# EAGLE schematic template (EAGLE 6.5.0)
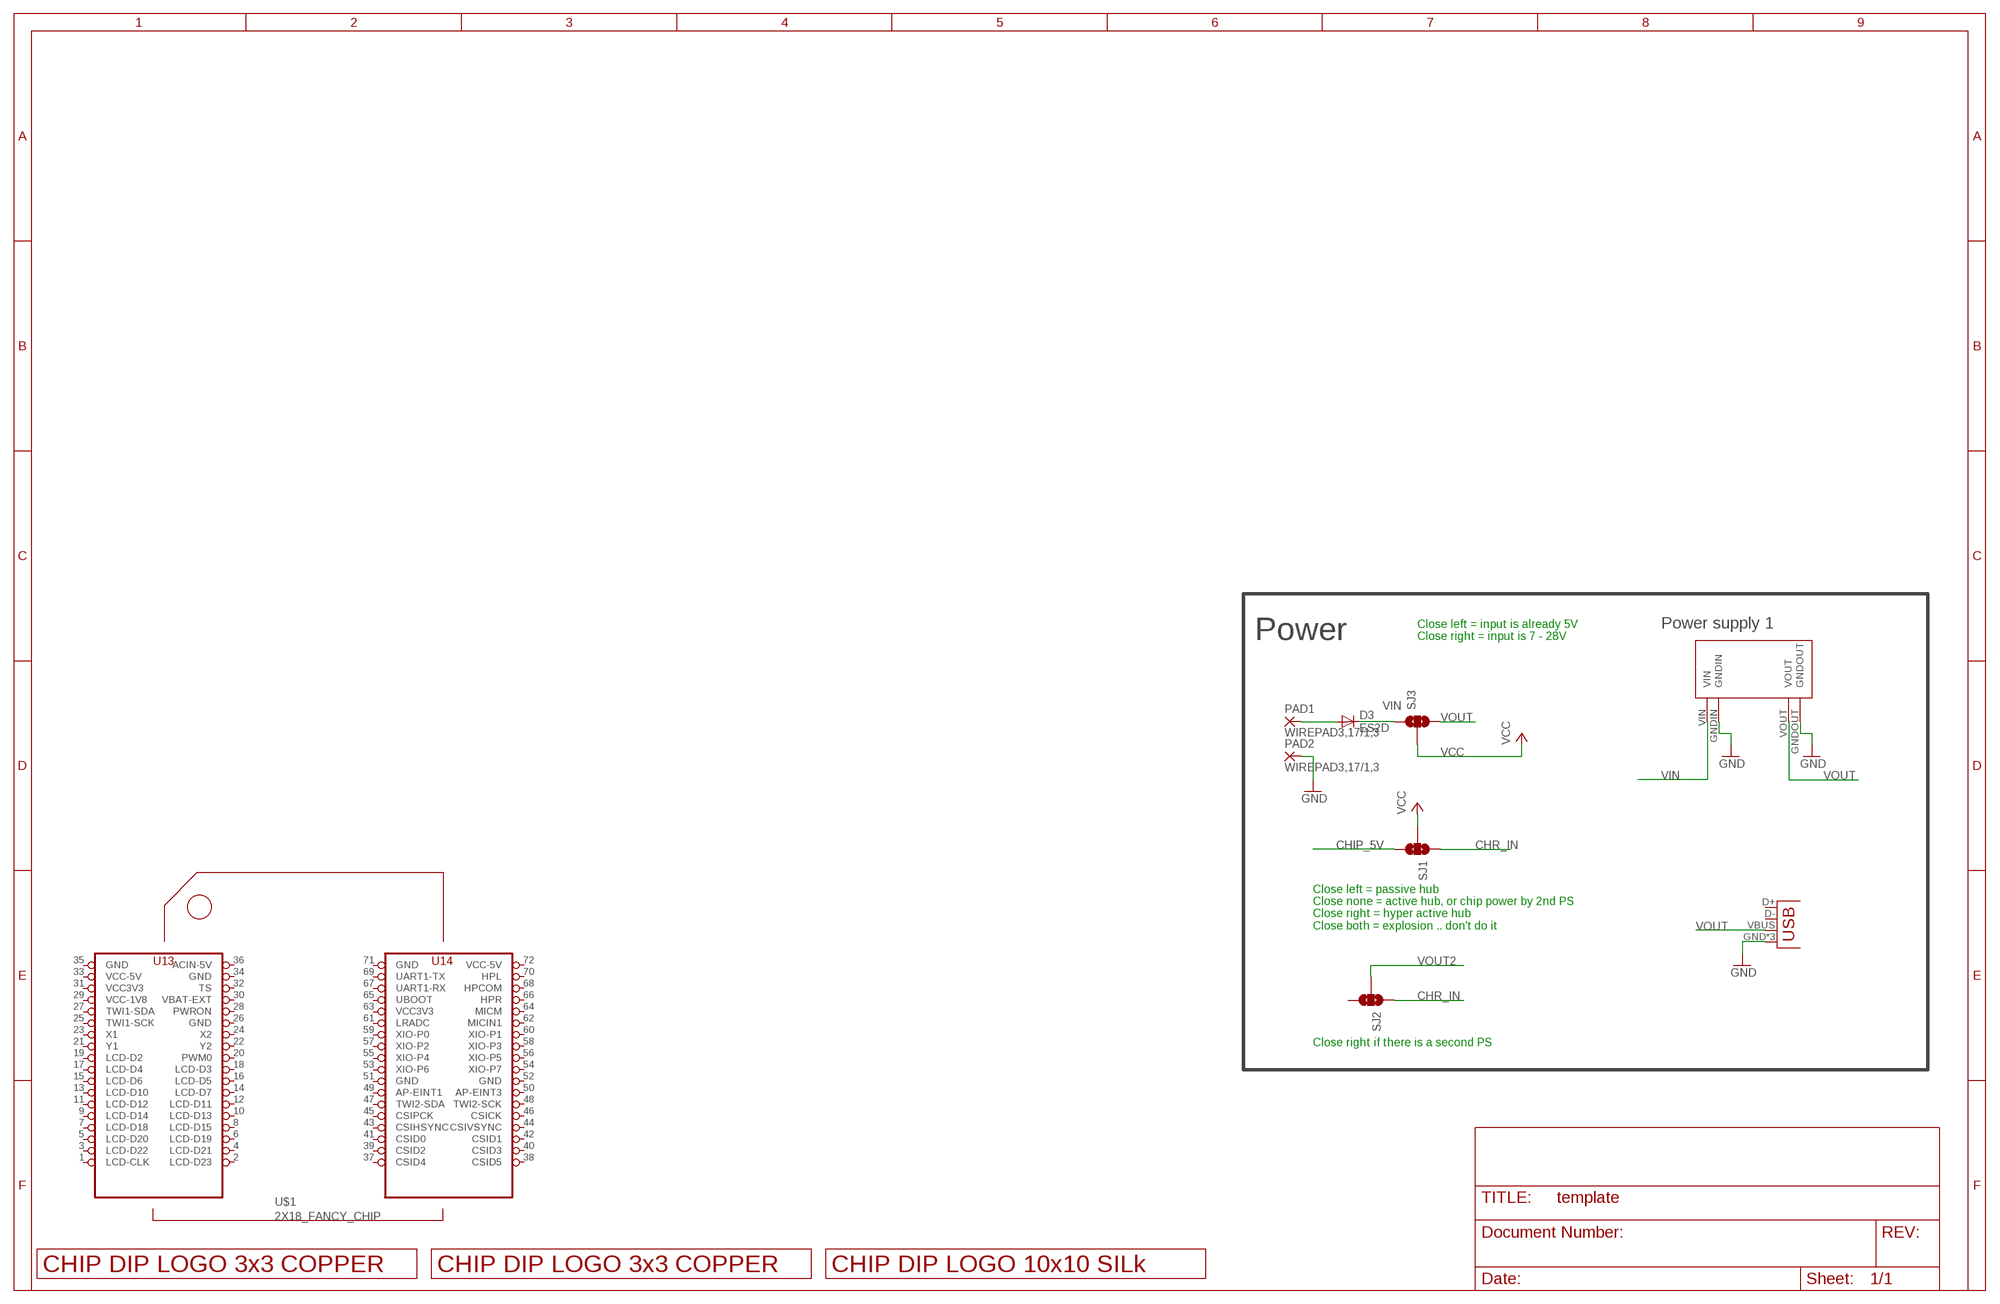
[diagram p0: schematic, sheet 1]

## Parts
D3  ES2D  [SMB]
PAD1  WIREPAD3,17/1,3  [3,17/1,3]
PAD2  WIREPAD3,17/1,3  [3,17/1,3]
POWER_USB  USBUSB-MICROB-SMT-DIP  [USB-MICROB-SMT-DIP]
SJ1  SOLDERJUMPER_2WAYT  [SJ_2]
SJ2  SOLDERJUMPER_2WAYT  [SJ_2]
SJ3  SOLDERJUMPER_2WAYT  [SJ_2]
U$1  2X18_FANCY_CHIP  [2X18_FANCY_EDGE_CHIP_TH]
U$4  LOGO_3X3_COPPER  [LOGO_3X3_COPPER]
U$5  LOGO_3X3_COPPER  [LOGO_3X3_COPPER]
U$6  LOGO_10X10_SILK  [LOGO_10X10_SILK]
U$9  MP1584EN  [MP1584EN]

## Nets
CHIP_5V: SJ1.3
CHR_IN: SJ1.1 SJ2.1
GND: PAD2.1(P) POWER_USB.GND POWER_USB.MT1(GND) POWER_USB.MT2(GND) U$9.GNDIN U$9.GNDOUT
N$2: D3.A PAD1.1(P)
VCC: SJ1.2 SJ3.2
VIN: D3.C SJ3.1 U$9.VIN
VOUT: POWER_USB.VBUS SJ3.3 U$9.VOUT
VOUT2: SJ2.2
Unconnected: POWER_USB.D+ POWER_USB.D- SJ2.3 U$1.1(LCD-CLK) U$1.2(LCD-D23) U$1.3(LCD-D22) U$1.4(LCD-D21) U$1.5(LCD-D20) U$1.6(LCD-D19) U$1.7(LCD-D18) U$1.8(LCD-D15) U$1.9(LCD-D14) U$1.10(LCD-D13) U$1.11(LCD-D12) U$1.12(LCD-D11) U$1.13(LCD-D10) U$1.14(LCD-D7) U$1.15(LCD-D6) U$1.16(LCD-D5) U$1.17(LCD-D4) U$1.18(LCD-D3) U$1.19(LCD-D2) U$1.20(PWM0) U$1.21(Y1) U$1.22(Y2) U$1.23(X1) U$1.24(X2) U$1.25(TWI1-SCK) U$1.27(TWI1-SDA) U$1.28(PWRON) U$1.30(VBAT-EXT) U$1.32(TS) U$1.36(ACIN-5V) U$1.37(CSID4) U$1.38(CSID5) U$1.39(CSID2) U$1.40(CSID3) U$1.41(CSID0) U$1.42(CSID1) U$1.43(CSIHSYNC) U$1.44(CSIVSYNC) U$1.45(CSIPCK) U$1.46(CSICK) U$1.47(TWI2-SDA) U$1.48(TWI2-SCK) U$1.49(AP-EINT1) U$1.50(AP-EINT3) U$1.53(XIO-P6) U$1.54(XIO-P7) U$1.55(XIO-P4) U$1.56(XIO-P5) U$1.57(XIO-P2) U$1.58(XIO-P3) U$1.59(XIO-P0) U$1.60(XIO-P1) U$1.61(LRADC) U$1.62(MICIN1) U$1.64(MICM) U$1.65(UBOOT) U$1.66(HPR) U$1.67(UART1-RX) U$1.68(HPCOM) U$1.69(UART1-TX) U$1.70(HPL)

## Notes on the sheet
- Power supply 1
- Power
- Close left = input is already 5V
  Close right = input is 7 - 28V
- Close left = passive hub
  Close none = active hub, or chip power by 2nd PS
  Close right = hyper active hub
  Close both = explosion .. don't do it
- Close right if there is a second PS

## Power pins joined to a net without a drawn wire
GND: U$1.26(GND) U$1.34(GND) U$1.35(GND) U$1.51(GND) U$1.52(GND) U$1.71(GND)
VCC3V3: U$1.31(VCC3V3) U$1.63(VCC3V3)
VCC-1V8: U$1.29(VCC-1V8)
VCC-5V: U$1.33(VCC-5V) U$1.72(VCC-5V)

## Library data of the parts
D3 = diode:ES2D: DIODE super fast rectifier, 2 A
PAD1 PAD2 = wirepad:WIREPAD: Wire PAD connect wire on PCB
POWER_USB = Spark:USB
SJ1-SJ3 = SparkFun-Retired:SOLDERJUMPER_2WAY: Solder Jumper 2 way solder jumper
U$1 = CHIP:2X18_FANCY_CHIP
U$4 U$5 = logo:LOGO_3X3_COPPER
U$6 = logo:LOGO_10X10_SILK
U$9 = power_supply:MP1584EN